# Altium schematic sheet peripheral.SchDoc
size A
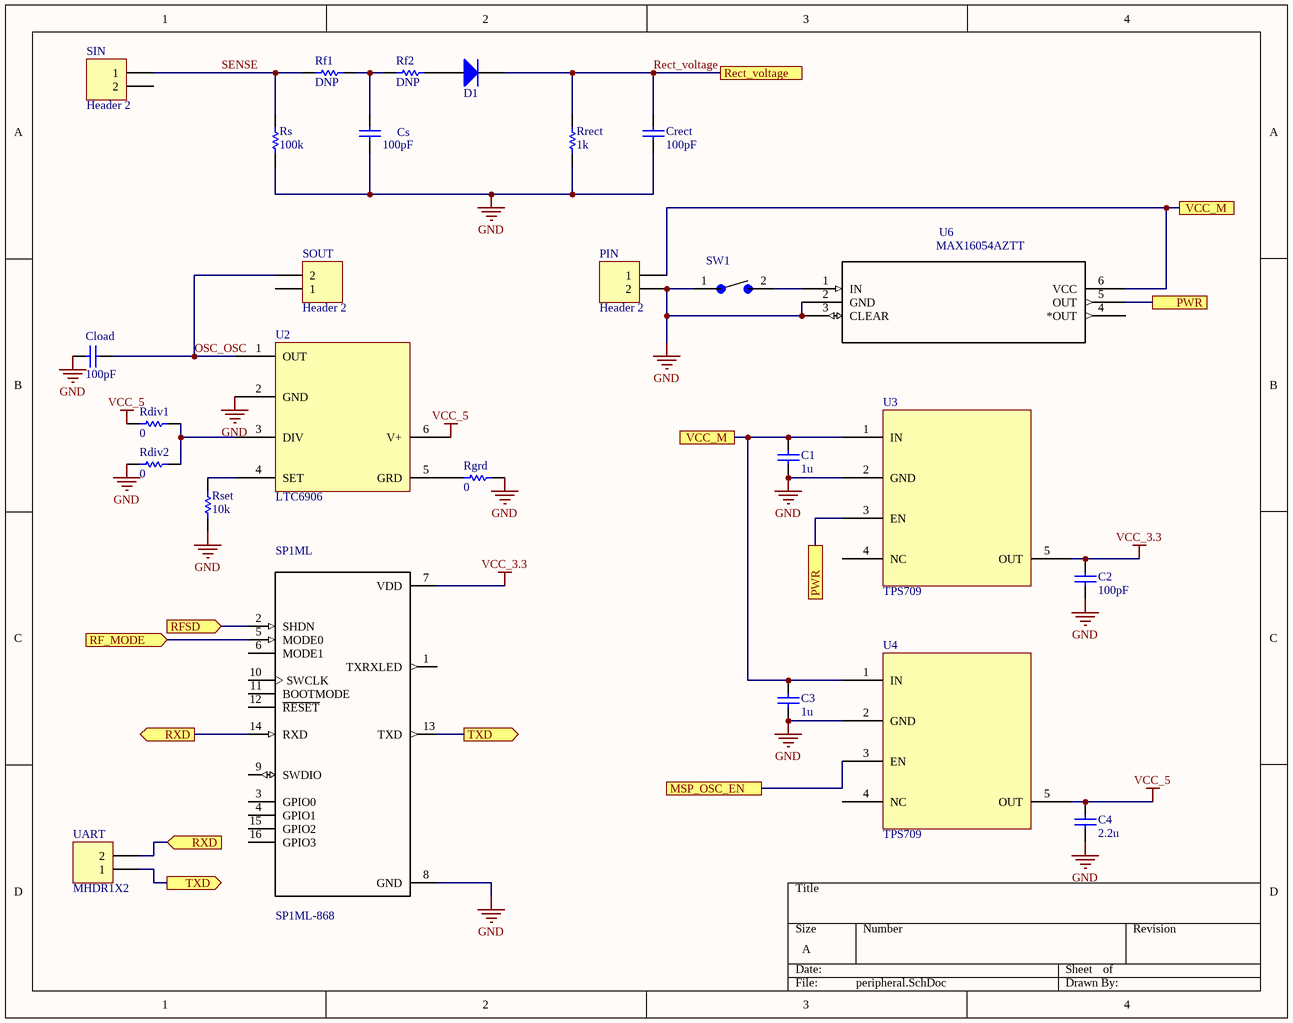
[diagram p0: peripheral.SchDoc]

## Parts
C1  value 1u  [0402-W]  (hidden comment: Cap)
C2  value 100pF  [0402-W]  (hidden comment: Cap)
C3  value 1u  [0402-W]  (hidden comment: Cap)
C4  value 2.2u  [0402-W]  (hidden comment: Cap)
Cload  value 100pF  [0402-W]  (hidden comment: Cap)
Crect  value 100pF  [0402-W]  (hidden comment: Cap)
Cs  value 100pF  [0402-W]  (hidden comment: Cap)
D1  Diode  [DIODE - SOD123]  (value not drawn)
PIN  Header 2  [HDR1X2]
Rdiv1  value 0  [0402]  (hidden comment: Res)
Rdiv2  value 0  [0402]  (hidden comment: Res)
Rf1  value DNP  [0402]  (hidden comment: Res)
Rf2  value DNP  [0402]  (hidden comment: Res)
Rgrd  value 0  [0402]  (hidden comment: Res)
Rrect  value 1k  [0402]  (hidden comment: Res)
Rs  value 100k  [0402]  (hidden comment: Res)
Rset  value 10k  [0402]  (hidden comment: Res)
SIN  Header 2  [HDR1X2]
SOUT  Header 2  [HDR1X2]
SP1ML  SP1ML-868  [STM_SP1ML-868]
SW1  FSMSM _1437566-3_  [TE_FSMSM]  (value not drawn)
U2  LTC6906  [6-Lead Plastic TSOT-23]
U3  TPS709  [SOT95P280X145-5N]
U4  TPS709  [SOT95P280X145-5N]
U6  MAX16054AZTT  [21-0114C]
UART  MHDR1X2  [MHDR1X2]

## Ports
MSP_OSC_EN, PWR, Rect_voltage, RF_MODE (in), RFSD (in), RXD (in), RXD (out), TXD (out), VCC_M

## Nets
GND: C1.1 C2.1 C3.1 C4.1 Cload.1 Crect.1 Cs.1 PIN.2 Rdiv2.1 Rgrd.2 Rrect.1 Rs.1 Rset.1 SP1ML.8(GND) SW1.1 U2.2(GND) U3.2(GND) U4.2(GND) U6.2(GND) U6.3(CLEAR)
VCC_3.3: C2.2 SP1ML.7(VDD) U3.5(OUT)
VCC_5: C4.2 Rdiv1.1 U2.6(V+) U4.5(OUT)
MSP_OSC_EN: U4.3(EN) ; port MSP_OSC_EN
OSC_OSC: Cload.2 SOUT.2 U2.1(OUT)
PWR: U3.3(EN) U6.5(OUT) ; port PWR
Rect_voltage: Crect.2 D1.2(C) Rrect.2 ; port Rect_voltage
RF_MODE: SP1ML.5(MODE0) ; port RF_MODE
RFSD: SP1ML.2(SHDN) ; port RFSD
RXD: SP1ML.14(RXD) UART.2 ; port RXD
SENSE: Rf1.1 Rs.2 SIN.1
TXD: SP1ML.13(TXD) UART.1 ; port TXD
VCC_M: C1.2 C3.2 PIN.1 U3.1(IN) U4.1(IN) U6.6(VCC) ; port VCC_M
NetCs_2: Cs.2 Rf1.2 Rf2.1
NetD1_1: D1.1(A) Rf2.2
NetRdiv1_2: Rdiv1.2 Rdiv2.2 U2.3(DIV)
NetRgrd_1: Rgrd.1 U2.5(GRD)
NetRset_2: Rset.2 U2.4(SET)
NetSW1_2: SW1.2 U6.1(IN)

Not connected (* = marked no-connect by the designer): SIN 2; SOUT 1; SP1ML 1(TXRXLED) 3(GPIO0) 4(GPIO1) 6(MODE1) 9(SWDIO) 10(SWCLK) 11(BOOTMODE) 12(~{RESET}) 15(GPIO2) 16(GPIO3); U3 4(NC); U4 4(NC); U6 4(*OUT)

## Library data of the parts
C1-C4 Cload Crect Cs = Cap: Ceramic Capacitor (Surface Mount); Manufacturer: Generic Ceramic Chip Cap (TBD); Digi-Key Part Number: *; Manufacturer Part Number: *; Note: *; Rating: *
D1 = Diode: General Purpose Diode; Manufacturer: *; Manufacturer Part Number: *; Digi-Key Part Number: *; Value: *; Rating: *; Note: *
PIN SIN SOUT = Header 2: Header, 2-Pin; LatestRevisionDate: 17-Jul-2002; LatestRevisionNote: Re-released for DXP Platform.; Publisher: Altium Limited
Rdiv1 Rdiv2 Rf1 Rf2 Rgrd Rrect Rs Rset = Res: Chip Resistor (Surface Mount); Manufacturer: Generic Chip Res (TBD); Manufacturer Part Number: *; Digi-Key Part Number: *; Rating: *
SP1ML = SP1ML-868: RF TXRX MODULE ISM<1GHZ CHIP ANT; MF: STMicroelectronics; Availability: Good; MP: SP1ML-868; Price: 16.88 USD; Package: SMD-16 STMicroelectronics; Value: *
SW1 = FSMSM: FSMSM=3.5X6 SMT TACT; MF: TE Connectivity; Price: None; SnapEDA_Link: https://www.snapeda.com/parts/FSMSM/TE%20Connectivity%20/%20DEUTSCH/view-part/?ref=snap; MP: FSMSM; Availability: Unavailable; Package: None; Value: *
U2 = LTC6906: LP Oscilloter
U3 U4 = TPS709: Ultra low power Voltage Regulator
U6 = MAX16054AZTT: On/Off Controller With Debounce And +/-1; MF: Maxim Integrated; MP: MAX16054AZT+; SnapEDA_Link: https://www.snapeda.com/parts/MAX16054AZT%2B/Maxim%20Integrated/view-part/?ref=snap; Package: TSOT-23 Maxim Integrated; Price: 2.94 USD; Availability: Unavailable; Value: *
UART = MHDR1X2: Header, 2-Pin; LatestRevisionDate: 17-Jul-2002; LatestRevisionNote: Re-released for DXP Platform.; Publisher: Altium Limited